# Altium schematic sheet MSP430G2553_MCU.SchDoc: Schematic Design of the MCU section
size 420 x 297 mm; Date: 24/07/2023; ApprovedBy: Sir Pramitha; CheckedBy: Sir Pramitha; Author: Intern Dilini; CompanyName: SLTMobitel; DrawnBy: Intern Dilini; Engineer: Sir Pramitha; Organization: SLT; Address1: Embryo Innovation Center; Address2: Telecom head office; DocumentNumber: 2; SheetNumber: 2; SheetTotal: 5; Time: 12:20
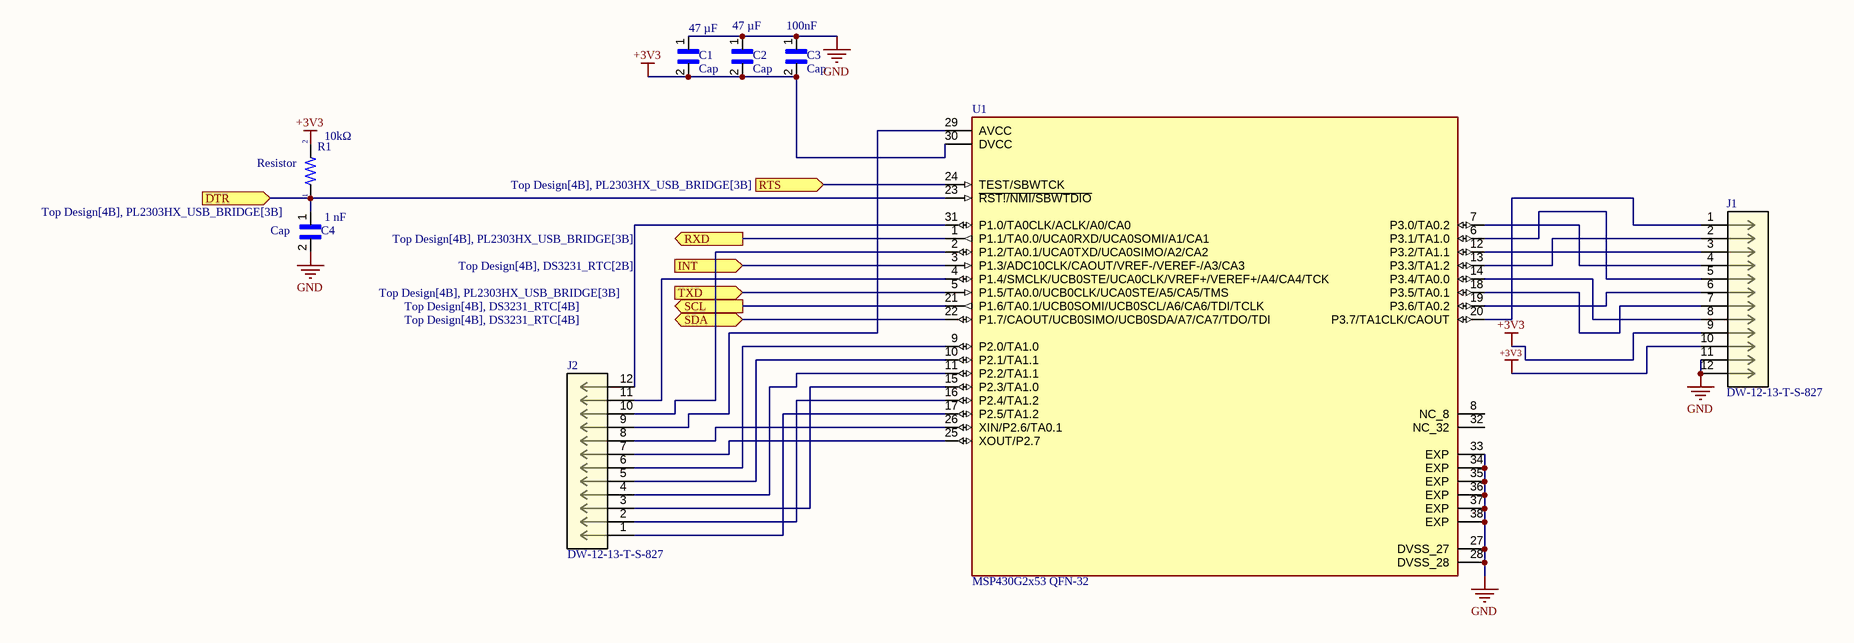
[diagram p0: MSP430G2553_MCU.SchDoc]

## Parts
C1  Cap  Capacitance: 47 µF  [Cap_0805]
C2  Cap  Capacitance: 47 µF  [Cap_0805]
C3  Cap  Capacitance: 100nF  [Cap_0805]
C4  Cap  Capacitance: 1 nF  [Cap_0805]
J1  DW-12-13-T-S-827  [CONN12-07-F-S-200_SAI]
J2  DW-12-13-T-S-827  [CONN12-07-F-S-200_SAI]
R1  Resistor  Parameter 1: 10kΩ  [Res_0603]
U1  MSP430G2x53 QFN-32  [MSP430G2x53_QFN]

## Ports
DTR (in, see Top Design[4B], PL2303HX_USB_BRIDGE[3B]), INT (in, see Top Design[4B], DS3231_RTC[2B]), RTS (in, see Top Design[4B], PL2303HX_USB_BRIDGE[3B]), RXD (out, see Top Design[4B], PL2303HX_USB_BRIDGE[3B]), SCL (out, see Top Design[4B], DS3231_RTC[4B]), SDA (bidir, see Top Design[4B], DS3231_RTC[4B]), TXD (in, see Top Design[4B], PL2303HX_USB_BRIDGE[3B])

## Nets
+3V3: C1.2 C2.2 C3.2 J1.9 J1.10 R1.2 U1.30(DVCC)
GND: C1.1 C2.1 C3.1 C4.2 J1.11 J1.12 U1.27(DVSS_27) U1.28(DVSS_28) U1.33(EXP) U1.34(EXP) U1.35(EXP) U1.36(EXP) U1.37(EXP) U1.38(EXP)
DTR: C4.1 R1.1 U1.23(~{RST!/NMI/SBWTDIO}) ; port DTR
INT: U1.3(P1.3/ADC10CLK/CAOUT/VREF-/VEREF-/A3/CA3) ; port INT
RTS: U1.24(TEST/SBWTCK) ; port RTS
RXD: U1.1(P1.1/TA0.0/UCA0RXD/UCA0SOMI/A1/CA1) ; port RXD
SCL: U1.21(P1.6/TA0.1/UCB0SOMI/UCB0SCL/A6/CA6/TDI/TCLK) ; port SCL
SDA: U1.22(P1.7/CAOUT/UCB0SIMO/UCB0SDA/A7/CA7/TDO/TDI) ; port SDA
TXD: U1.5(P1.5/TA0.0/UCB0CLK/UCA0STE/A5/CA5/TMS) ; port TXD
NetJ1_1: J1.1 U1.20(P3.7/TA1CLK/CAOUT)
NetJ1_2: J1.2 U1.13(P3.3/TA1.2)
NetJ1_3: J1.3 U1.12(P3.2/TA1.1)
NetJ1_4: J1.4 U1.7(P3.0/TA0.2)
NetJ1_5: J1.5 U1.6(P3.1/TA1.0)
NetJ1_6: J1.6 U1.19(P3.6/TA0.2)
NetJ1_7: J1.7 U1.18(P3.5/TA0.1)
NetJ1_8: J1.8 U1.14(P3.4/TA0.0)
NetJ2_1: J2.1 U1.17(P2.5/TA1.2)
NetJ2_2: J2.2 U1.16(P2.4/TA1.2)
NetJ2_3: J2.3 U1.15(P2.3/TA1.0)
NetJ2_4: J2.4 U1.11(P2.2/TA1.1)
NetJ2_5: J2.5 U1.10(P2.1/TA1.1)
NetJ2_6: J2.6 U1.9(P2.0/TA1.0)
NetJ2_7: J2.7 U1.25(XOUT/P2.7)
NetJ2_8: J2.8 U1.26(XIN/P2.6/TA0.1)
NetJ2_9: J2.9 U1.29(AVCC)
NetJ2_10: J2.10 U1.2(P1.2/TA0.1/UCA0TXD/UCA0SIMO/A2/CA2)
NetJ2_11: J2.11 U1.4(P1.4/SMCLK/UCB0STE/UCA0CLK/VREF+/VEREF+/A4/CA4/TCK)
NetJ2_12: J2.12 U1.31(P1.0/TA0CLK/ACLK/A0/CA0)

Not connected (* = marked no-connect by the designer): U1 8(NC_8) 32(NC_32)

## Notes on the sheet
- THIS DOCUMENT AND THE DATA DISCLOSED HEREIN OR
- HEREWITH IS THE PROPERTY OF ALTIUM LIMITED AND MAY
- DWG NO:
- REVISION
- REV:
- DESCRIPTION
- DATE
- APPROVED
- BE FREELY DISTRIBUTED IN WHOLE. NO RIGHTS ARE
- RESERVED OR EXPRESS OR IMPLIED WARANTEE GIVEN.
- ENG:
- APPROVALS
- PROJECT
- DSN:
- CHK:
- REFERENCE DOCUMENTS
- PROJECT REVISION:
- TITLE
- DOCUMENT REVISION:
- DESIGN ITEM:
- BOM:
- FAB DWG:
- PCB DWG:
- ASSY DWG:
- SCALE:
- A3
- SIZE
- CAGE CODE
- FILE NAME
- DWG NO.
- SHEET
- OF
- REV

## Library data of the parts
J1 J2 = DW-12-13-T-S-827: No Description Available; Mfr_Name: Samtec Inc; RefDes: RefDes; Type: Type
U1 = MSP430G2x53 QFN-32: QFN-32-EP(5x5) Microcontroller Units (MCUs/MPUs/SOCs) ROHS. Texas Instruments.; MP: MSP430G2553IRHB32R; Value: *; Availability: Unavailable; Package: None; Price: None; ComponentLink1Description: LSCS; ComponentLink1URL: https://www.lcsc.com/product-detail/Microcontroller-Units-MCUs-MPUs-SOCs_Texas-Instruments-MSP430G2553IRHB32R_C27832.html